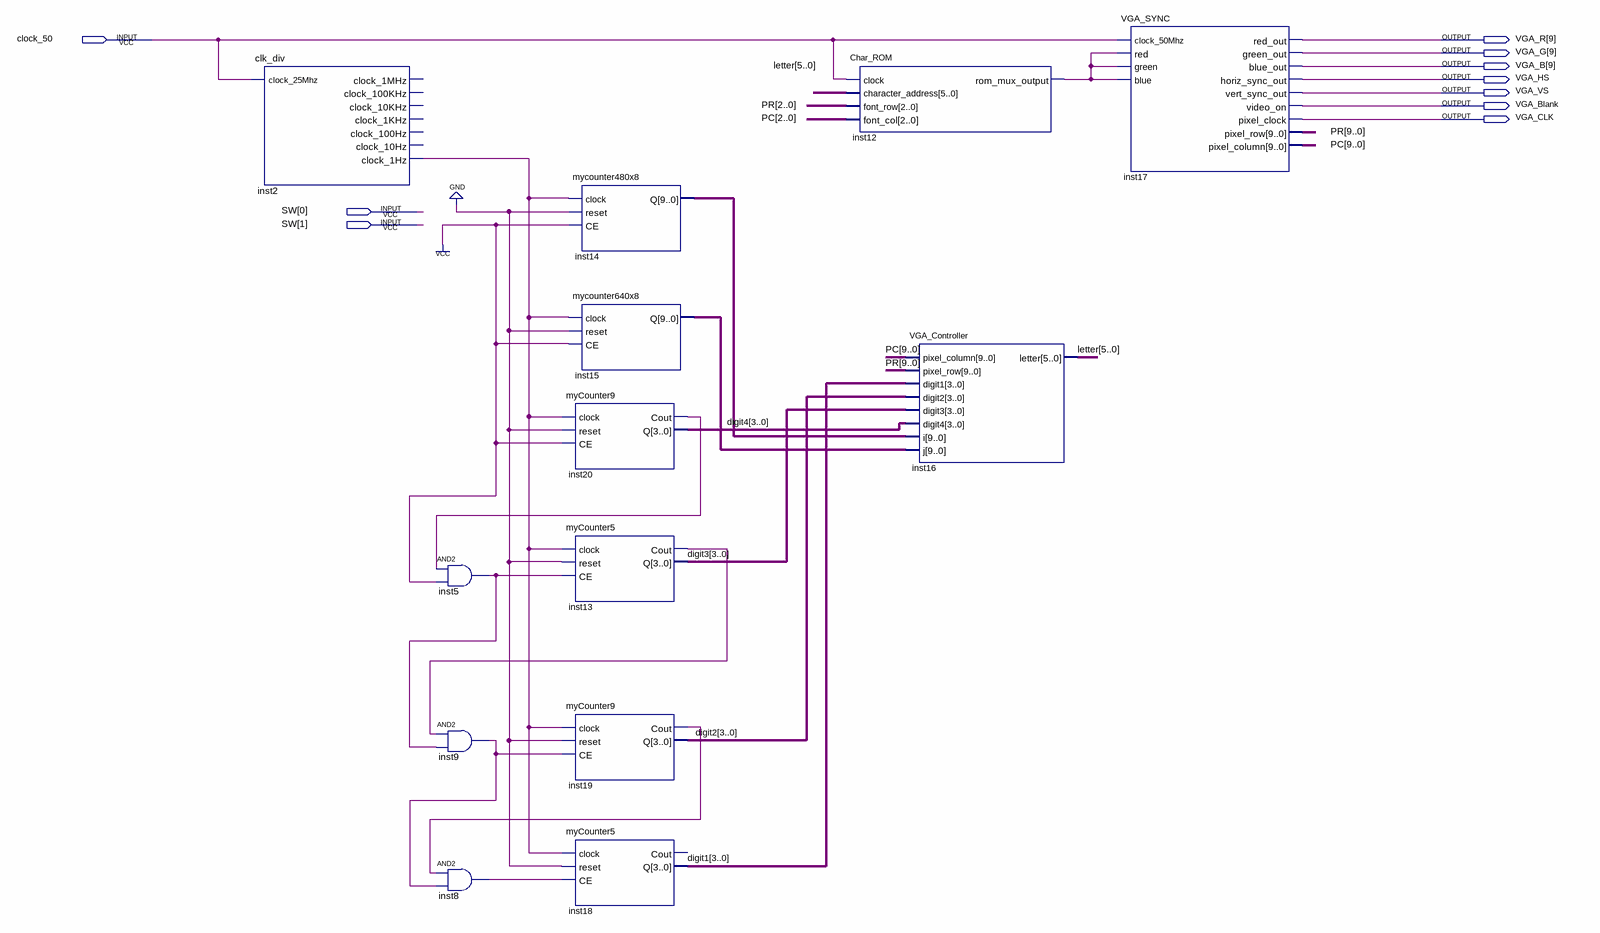
[diagram p0: schematic sheet]
// Quartus schematic all.bdf as structural Verilog: 13 symbols, 10 pins
module all (
  input  clock_50,
  input  [1:0] SW,
  output [9:9] VGA_R,
  output [9:9] VGA_G,
  output [9:9] VGA_B,
  output VGA_HS,
  output VGA_VS,
  output VGA_Blank,
  output VGA_CLK
);

  wire inst2_clock_1hz, inst5_out, inst8_out, inst9_out, inst12_rom_mux_output, inst13_cout, inst19_cout,
       inst20_cout;
  wire [3:0] digit1, digit2, digit3, digit4;
  wire [5:0] letter;
  wire [9:0] inst14_q, inst15_q, PC, PR;

  clk_div inst2 (
    .clock_25Mhz(clock_50), .clock_1Hz(inst2_clock_1hz));  // open: clock_1MHz, clock_100KHz, clock_10KHz, clock_1KHz, clock_100Hz, clock_10Hz
  and inst5 (inst5_out, inst20_cout, 1'b1);
  and inst9 (inst9_out, inst13_cout, inst5_out);
  and inst8 (inst8_out, inst19_cout, inst9_out);
  myCounter9 inst20 (.clock(inst2_clock_1hz), .reset(1'b0), .CE(1'b1), .Cout(inst20_cout), .Q(digit4));
  myCounter5 inst13 (.clock(inst2_clock_1hz), .reset(1'b0), .CE(inst5_out), .Cout(inst13_cout), .Q(digit3));
  myCounter9 inst19 (.clock(inst2_clock_1hz), .reset(1'b0), .CE(inst9_out), .Cout(inst19_cout), .Q(digit2));
  myCounter5 inst18 (.clock(inst2_clock_1hz), .reset(1'b0), .CE(inst8_out), .Q(digit1));  // open: Cout
  mycounter480x8 inst14 (.clock(inst2_clock_1hz), .reset(1'b0), .CE(1'b1), .Q(inst14_q));
  mycounter640x8 inst15 (.clock(inst2_clock_1hz), .reset(1'b0), .CE(1'b1), .Q(inst15_q));
  Char_ROM inst12 (
    .clock(clock_50), .character_address(letter), .font_row(PR[2:0]), .font_col(PC[2:0]),
    .rom_mux_output(inst12_rom_mux_output));
  VGA_Controller inst16 (
    .pixel_column(PC), .pixel_row(PR), .digit1(digit1), .digit2(digit2), .digit3(digit3), .digit4(digit4),
    .i(inst14_q), .j(inst15_q), .letter(letter));
  VGA_SYNC inst17 (
    .clock_50Mhz(clock_50), .red(inst12_rom_mux_output), .green(inst12_rom_mux_output),
    .blue(inst12_rom_mux_output), .red_out(VGA_R[9]), .green_out(VGA_G[9]), .blue_out(VGA_B[9]),
    .horiz_sync_out(VGA_HS), .vert_sync_out(VGA_VS), .video_on(VGA_Blank), .pixel_clock(VGA_CLK),
    .pixel_row(PR), .pixel_column(PC));
endmodule
